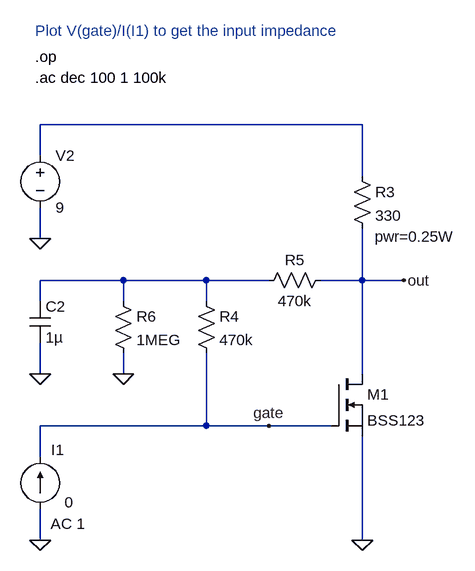
[diagram p0: schematic zin_mosfet.asc]
zin_mosfet.asc, the LTspice schematic file:
Version 4
SHEET 1 1136 680
WIRE 480 -192 480 -240
WIRE 480 -64 480 -112
WIRE 480 32 480 0
WIRE 480 144 480 96
WIRE 480 272 480 224
WIRE 480 400 480 352
WIRE 608 0 480 0
WIRE 608 32 608 0
WIRE 608 144 608 112
WIRE 736 0 608 0
WIRE 736 32 736 0
WIRE 736 224 480 224
WIRE 736 224 736 112
WIRE 832 0 736 0
WIRE 832 224 736 224
WIRE 928 224 832 224
WIRE 976 -240 480 -240
WIRE 976 -160 976 -240
WIRE 976 0 912 0
WIRE 976 0 976 -80
WIRE 976 144 976 0
WIRE 976 400 976 240
WIRE 1040 0 976 0
FLAG 976 400 0
FLAG 480 400 0
FLAG 1040 0 out
FLAG 832 224 gate
FLAG 480 144 0
FLAG 608 144 0
FLAG 480 -64 0
SYMBOL nmos 928 144 R0
SYMATTR InstName M1
SYMATTR Value BSS123
SYMBOL res 960 -176 R0
WINDOW 39 35 109 Left 0
SYMATTR InstName R3
SYMATTR Value 330
SYMATTR SpiceLine pwr=0.25W
SYMBOL res 720 16 R0
SYMATTR InstName R4
SYMATTR Value 470k
SYMBOL current 480 352 R180
WINDOW 0 -37 91 Left 0
WINDOW 3 -51 10 Left 0
WINDOW 123 -69 -23 Left 0
WINDOW 39 0 0 Left 0
SYMATTR InstName I1
SYMATTR Value 0
SYMATTR Value2 AC 1
SYMBOL res 816 16 R270
WINDOW 0 32 56 VTop 0
WINDOW 3 0 56 VBottom 0
SYMATTR InstName R5
SYMATTR Value 470k
SYMBOL cap 464 32 R0
SYMATTR InstName C2
SYMATTR Value 1µ
SYMBOL res 592 16 R0
SYMATTR InstName R6
SYMATTR Value 1MEG
SYMBOL voltage 480 -208 R0
WINDOW 123 24 132 Left 0
WINDOW 39 0 0 Left 0
SYMATTR InstName V2
SYMATTR Value 9
TEXT 472 -344 Left 0 !.op
TEXT 472 -312 Left 0 !.ac dec 100 1 100k
TEXT 472 -384 Left 0 ;Plot V(gate)/I(I1) to get the input impedance

The netlist it stands for:
* zin_mosfet.asc
M1 out gate 0 0 BSS123
R3 N001 out 330 pwr=0.25W
R4 N002 gate 470k
I1 0 gate 0 AC 1
R5 N002 out 470k
C2 N002 0 1µ
R6 N002 0 1MEG
V2 N001 0 9
.model NMOS NMOS
.model PMOS PMOS
.lib standard.mos
.op
.ac dec 100 1 100k
* Plot V(gate)/I(I1) to get the input impedance
.backanno
.end